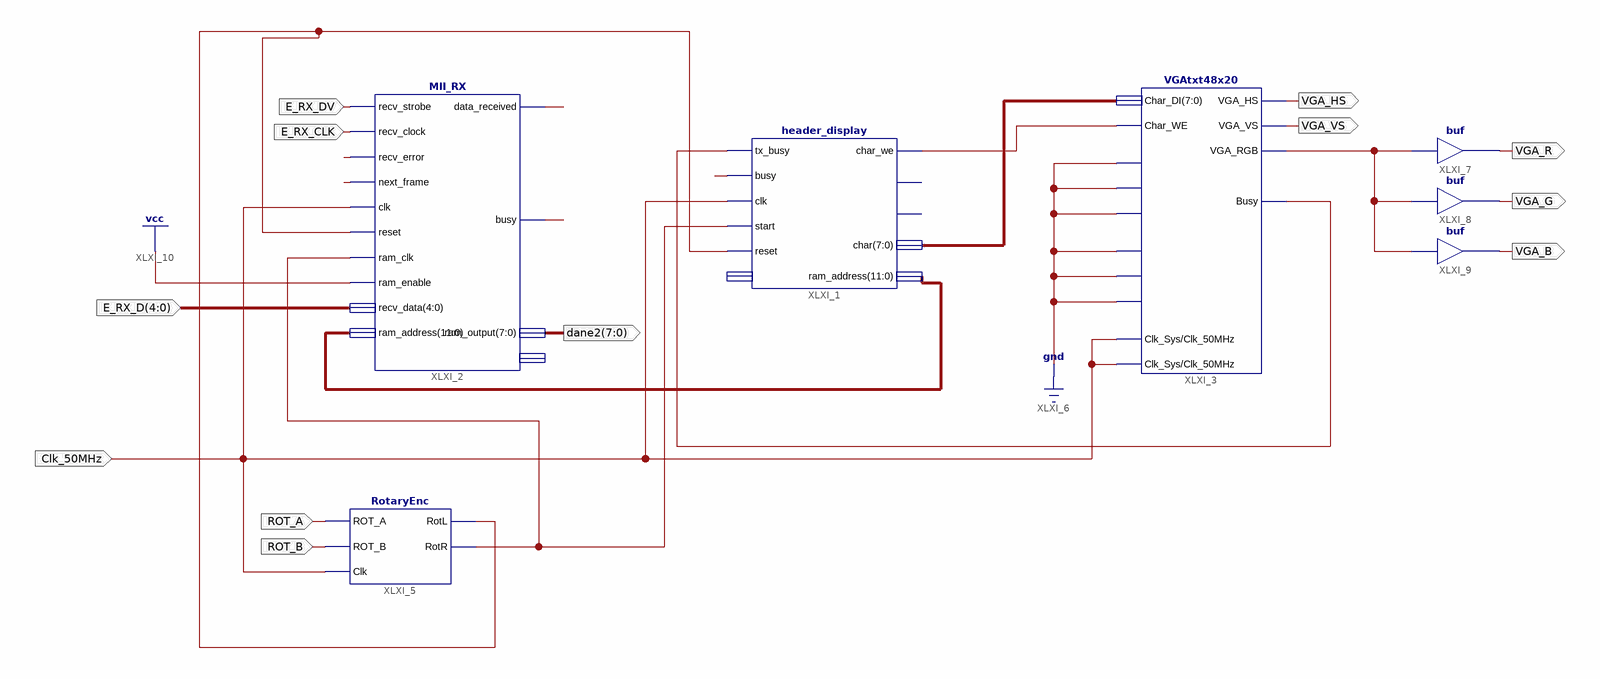
[diagram p0: schematic sheet 1]
// Xilinx ISE schematic MII_test3.sch (spartan3e) as structural Verilog: 7 symbols, 12 ports
module MII_test3 (
  input  Clk_50MHz,
  input  E_RX_DV,
  input  E_RX_CLK,
  input  [4:0] E_RX_D,
  input  ROT_B,
  input  ROT_A,
  output VGA_HS,
  output VGA_VS,
  output VGA_B,
  output VGA_G,
  output VGA_R,
  output [7:0] dane2
);

  wire led0, led1, led2, XLXN_2, XLXN_3, XLXN_5, XLXN_19, XLXN_20, XLXN_24, XLXN_31;
  wire [7:0] XLXN_6;
  wire [11:0] XLXN_9;

  header_display XLXI_1 (
    .tx_busy(XLXN_2), .busy(XLXN_24), .clk(Clk_50MHz), .start(XLXN_3), .reset(led0), .char_we(XLXN_5),
    .char(XLXN_6), .ram_address(XLXN_9));  // open: ram_output, ram_clk, ram_enable
  MII_RX XLXI_2 (
    .recv_strobe(E_RX_DV), .recv_clock(E_RX_CLK), .recv_error(XLXN_19), .next_frame(XLXN_20),
    .clk(Clk_50MHz), .reset(led0), .ram_clk(XLXN_3), .ram_enable(1'b1), .recv_data(E_RX_D),
    .ram_address(XLXN_9), .data_received(led1), .busy(led2), .ram_output(dane2));  // open: test
  VGAtxt48x20 XLXI_3 (
    .Char_DI(XLXN_6), .Home(1'b0), .NewLine(1'b0), .Goto00(1'b0), .Clk_Sys(Clk_50MHz), .Clk_50MHz(Clk_50MHz),
    .CursorOn(1'b0), .ScrollEn(1'b0), .ScrollClear(1'b0), .Busy(XLXN_2), .VGA_HS(VGA_HS), .VGA_VS(VGA_VS),
    .VGA_RGB(XLXN_31), .Char_WE(XLXN_5));
  RotaryEnc XLXI_5 (.ROT_A(ROT_A), .ROT_B(ROT_B), .RotL(led0), .RotR(XLXN_3), .Clk(Clk_50MHz));
  buf XLXI_7 (VGA_R, XLXN_31);
  buf XLXI_8 (VGA_G, XLXN_31);
  buf XLXI_9 (VGA_B, XLXN_31);
endmodule
